# Altium schematic sheet MRF24J40MA.SchDoc
size A
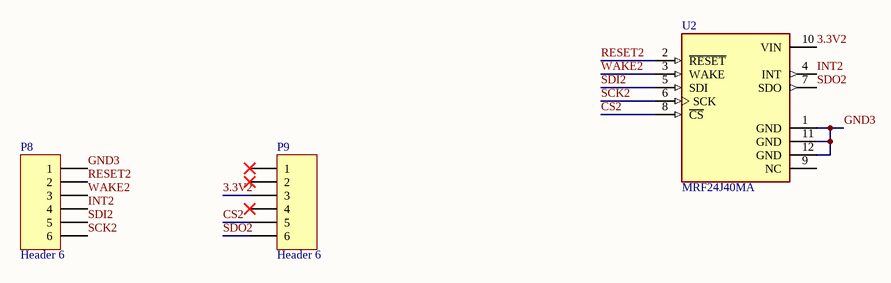
[diagram p0: MRF24J40MA.SchDoc]

## Parts
P8  Header 6  [HDR1X6]
P9  Header 6  [HDR1X6]
U2  MRF24J40MA  [MODULE_MRF24J40MA]

## Nets
3.3V2: P9.3 U2.10(VIN)
CS2: P9.5 U2.8(~{CS})
GND3: P8.1 U2.1(GND) U2.11(GND) U2.12(GND)
INT2: P8.4 U2.4(INT)
RESET2: P8.2 U2.2(~{RESET})
SCK2: P8.6 U2.6(SCK)
SDI2: P8.5 U2.5(SDI)
SDO2: P9.6 U2.7(SDO)
WAKE2: P8.3 U2.3(WAKE)

Not connected (* = marked no-connect by the designer): P9 1* 2* 4*; U2 9(NC)

## Library data of the parts
P8 P9 = Header 6: Header, 6-Pin; LatestRevisionDate: 17-Jul-2002; LatestRevisionNote: Re-released for DXP Platform.; Publisher: Altium Limited
U2 = MRF24J40MA: 802.15.4 Zigbee Transceiver Module 2.4GHz Integrated, Trace Surface Mount; MF: {'manufacturer': u'Microchip'}; MP: MRF24J40MA; Availability: Unavailable; Value: *; Package: None; Price: None